# EAGLE design Board_v2 (EAGLE 8.1.0)
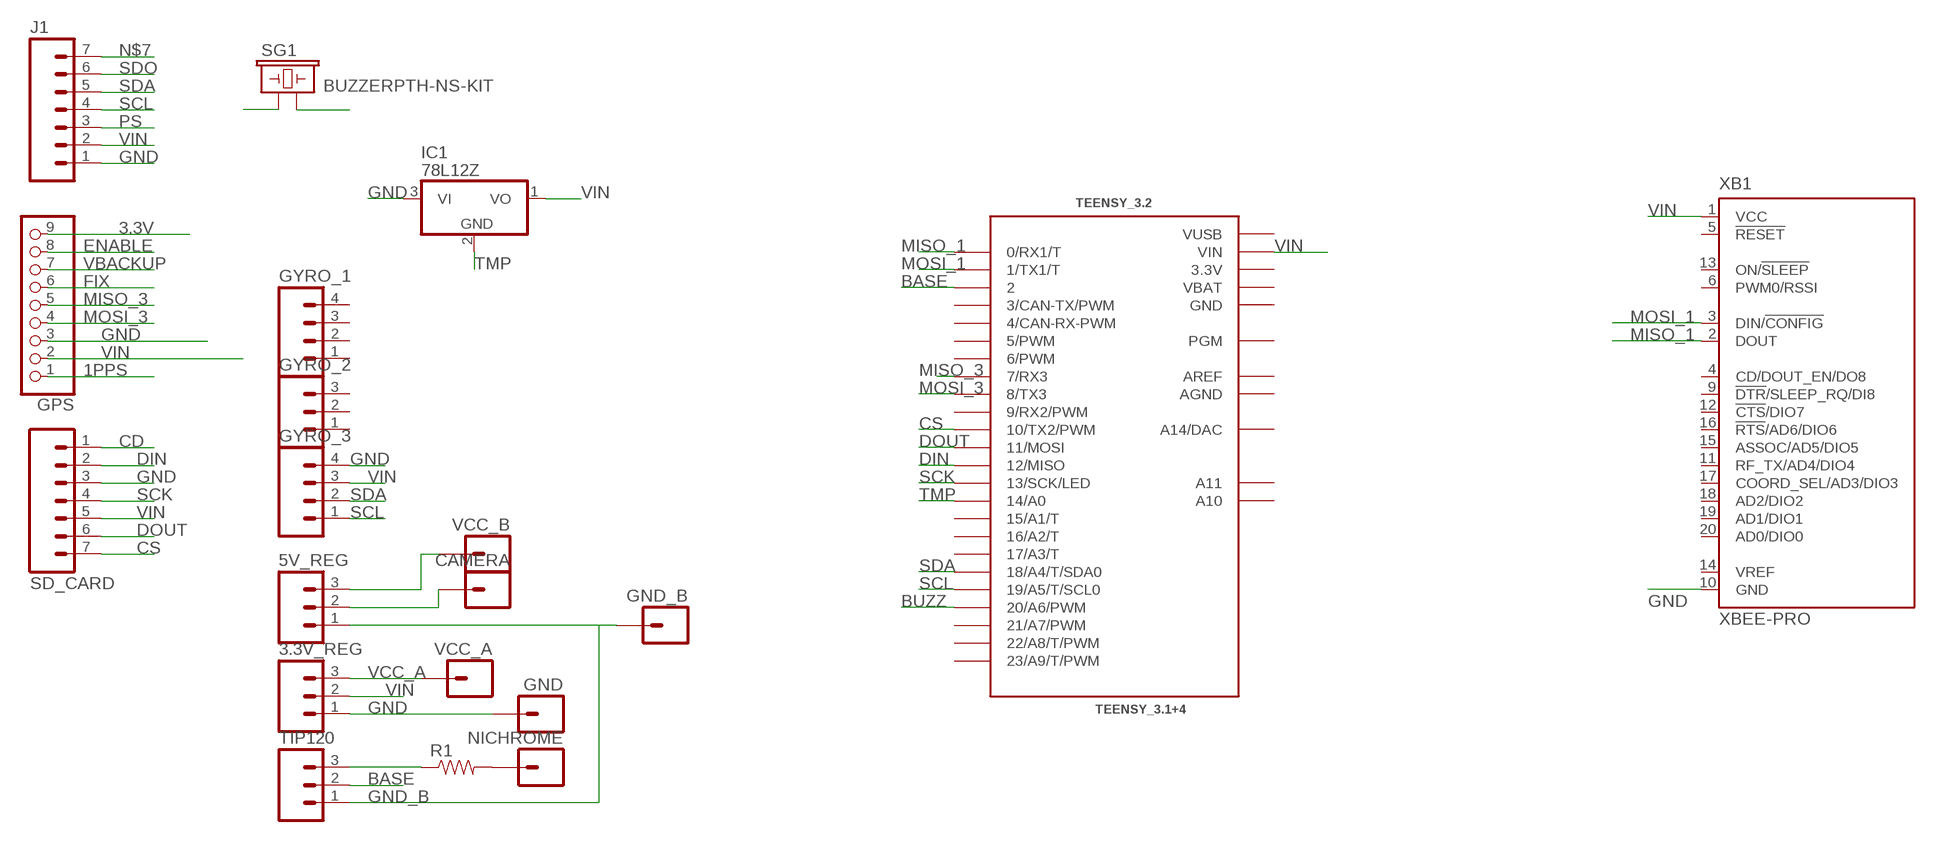
[diagram p0: schematic, sheet 1]

## Parts
3.3V_REG  M03PTH  [1X03]
5V_REG  M03PTH  [1X03]
CAMERA  M01NOSILK-KIT  [1X01NS-KIT]
GND  M01PTH_LONGPAD  [1X01_LONGPAD]
GND_B  M01OFFSET  [1X01_OFFSET]
GPS  HEADER-1X970MIL  [1X09_ROUND_70]
GYRO_1  M04PTH  [1X04]
GYRO_2  M03PTH  [1X03]
GYRO_3  M04PTH  [1X04]
IC1  78L12Z  [TO92]
J1  M07  [1X07]
NICHROME  M01OFFSET  [1X01_OFFSET]
R1  RESISTOREZ  [AXIAL-0.3EZ]
SD_CARD  M07  [1X07]
SG1  BUZZERPTH-NS-KIT  [BUZZER-12MM-NS-KIT]
TEENSY_3.2  TEENSY_3.1+4  [TEENSY_3.1+4]
TIP120  M03PTH  [1X03]
VCC_A  M01PTH_LONGPAD  [1X01_LONGPAD]
VCC_B  M01OFFSET  [1X01_OFFSET]
XB1  XBEE-PRO  [XBEE-PRO]

## Nets
1PPS: GPS.1
3.3V: GPS.9
BASE: TEENSY_3.2.2 TIP120.2
BUZZ: SG1.+ TEENSY_3.2.20/A6(20/A6/PWM)
CD: SD_CARD.1
CS: SD_CARD.7 TEENSY_3.2.10(10/TX2/PWM)
DIN: SD_CARD.2 TEENSY_3.2.12(12/MISO)
DOUT: SD_CARD.6 TEENSY_3.2.11(11/MOSI)
ENABLE: GPS.8
FIX: GPS.6
GND: 3.3V_REG.1 GND.1 GPS.3 GYRO_3.4 IC1.3(VI) J1.1 SD_CARD.3 SG1.- XB1.10(GND)
GND_B: 5V_REG.1 GND_B.1 TIP120.1
MISO_1: TEENSY_3.2.0(0/RX1/T) XB1.2(DOUT)
MISO_3: GPS.5 TEENSY_3.2.7(7/RX3)
MOSI_1: TEENSY_3.2.1(1/TX1/T) XB1.3(DIN/!CONFIG)
MOSI_3: GPS.4 TEENSY_3.2.8(8/TX3)
N$1: NICHROME.1 R1.P$2
N$2: R1.P$1 TIP120.3
N$4: 5V_REG.2 CAMERA.1
N$5: 5V_REG.3 VCC_B.1
N$7: J1.7
PS: J1.3
SCK: SD_CARD.4 TEENSY_3.2.13(13/SCK/LED)
SCL: GYRO_3.1 J1.4 TEENSY_3.2.19/A5(19/A5/T/SCL0)
SDA: GYRO_3.2 J1.5 TEENSY_3.2.18/A4(18/A4/T/SDA0)
SDO: J1.6
TMP: IC1.2(GND) TEENSY_3.2.14/A0
VBACKUP: GPS.7
VCC_A: 3.3V_REG.3 VCC_A.1
VIN: 3.3V_REG.2 GPS.2 GYRO_3.3 IC1.1(VO) J1.2 SD_CARD.5 TEENSY_3.2.VIN XB1.1(VCC)
Unconnected: GYRO_1.1 GYRO_1.2 GYRO_1.3 GYRO_1.4 GYRO_2.1 GYRO_2.2 GYRO_2.3 TEENSY_3.2.3(3/CAN-TX/PWM) TEENSY_3.2.4(4/CAN-RX-PWM) TEENSY_3.2.5(5/PWM) TEENSY_3.2.6(6/PWM) TEENSY_3.2.9(9/RX2/PWM) TEENSY_3.2.15/A1(15/A1/T) TEENSY_3.2.16/A2(16/A2/T) TEENSY_3.2.17/A3(17/A3/T) TEENSY_3.2.21/A7(21/A7/PWM) TEENSY_3.2.22/A8(22/A8/T/PWM) TEENSY_3.2.23/A9(23/A9/T/PWM) TEENSY_3.2.A10 TEENSY_3.2.A11 TEENSY_3.2.A14(A14/DAC) TEENSY_3.2.PGM XB1.4(CD/DOUT_EN/DO8) XB1.5(!RESET) XB1.6(PWM0/RSSI) XB1.9(!DTR!/SLEEP_RQ/DI8) XB1.11(RF_TX/AD4/DIO4) XB1.12(!CTS!/DIO7) XB1.13(ON/!SLEEP) XB1.14(VREF) XB1.15(ASSOC/AD5/DIO5) XB1.16(!RTS!/AD6/DIO6) XB1.17(COORD_SEL/AD3/DIO3) XB1.18(AD2/DIO2) XB1.19(AD1/DIO1) XB1.20(AD0/DIO0)

## Power pins joined to a net without a drawn wire
3.3V: TEENSY_3.2.3.3V TEENSY_3.2.3.3V1(3.3V)
AGND: TEENSY_3.2.AGND
AREF: TEENSY_3.2.AREF
GND: TEENSY_3.2.GND TEENSY_3.2.GND1(GND)
VBAT: TEENSY_3.2.VBAT
VUSB: TEENSY_3.2.VUSB

## Library data of the parts
3.3V_REG 5V_REG GYRO_2 TIP120 = SparkFun-Connectors:M03: Header 3 Standard 3-pin 0.1" header. Use with straight break away headers (SKU : PRT-00116), right angle break away headers (PRT-00553), swiss pins (PRT-00743), machine pins (PRT-00117), and female headers (PRT-00115). Molex polarized connector foot print use with SKU : PRT-08232 with associated crimp pins and housings.
CAMERA GND GND_B VCC_A VCC_B = SparkFun-Connectors:M01: Header 1
GPS = microbuilder:HEADER-1X9: PIN HEADER
GYRO_1 GYRO_3 = SparkFun-Connectors:M04: Header 4 Standard 4-pin 0.1" header. Use with straight break away headers (SKU : PRT-00116), right angle break away headers (PRT-00553), swiss pins (PRT-00743), machine pins (PRT-00117), and female headers (PRT-00115). Molex polarized connector foot print use with SKU : PRT-08231 with associated crimp pins and housings. 1MM SMD Version SKU: PRT-10208; PROD_ID: CONN-09696
IC1 = adafruit:78*: Positive VOLTAGE REGULATOR Added bigger pads to the TO-92 package
J1 SD_CARD = SparkFun-Connectors:M07: Header 7 Standard 7-pin 0.1" header. Use with straight break away headers (SKU : PRT-00116), right angle break away headers (PRT-00553), swiss pins (PRT-00743), machine pins (PRT-00117), and female headers (PRT-00115). NOTES ON THE VARIANTS LOCK and LOCK_LONGPADS... This footprint was designed to help hold the alignment of a through-hole component (i.e. 7-pin header) while soldering it into place. You may notice that each hole has been shifted either up or down by 0.005 of an inch from it's more standard position (which is usually a perfectly straight line). This slight alteration caused the pins (the squares in the middle) to touch the edges of the holes. Because they are alternating, it causes a "brace" to hold the header in place. 0.005 has proven to be the perfect amount of "off-center" position when using our standard breakaway headers. Although looks a little odd when you look at the bare footprint, once you have a header in there, the alteration is very hard to notice. Also, if you push a header all the way into place, it is covered up entirely on the bottom side. This idea of altering the position of holes to aid alignment will be further integrated into the Sparkfun Library for other footprints. It can help hold any component with 3 or more connection pins.
NICHROME = SparkFun:M01: Header 1
R1 = SparkFun-Passives:RESISTOR: Resistor Basic schematic elements and footprints for 0603, 1206, and PTH resistors.
SG1 = SparkFun:BUZZER: Buzzer 12mm Spark Fun Electronics SKU : Comp-Buzzer
TEENSY_3.2 = Teensy_3_Series_Board_v1.0:TEENSY_3.1+4: Footprint for Teensy 3.1 board using all through-holes, i.e. the entire perimeter plus the 4 through-holes inboard (A10,A11,AREF, VUSB)
XB1 = maxstream:XBEE: XBee (TM) /XBee-PRO(TM) OEM RF Modules Source: MaxStream, Inc. xbee_productmanual.pdf; MPN: XBP24-AWI-001; OC_FARNELL: 1337916; OC_NEWARK: 42M2667

## Board
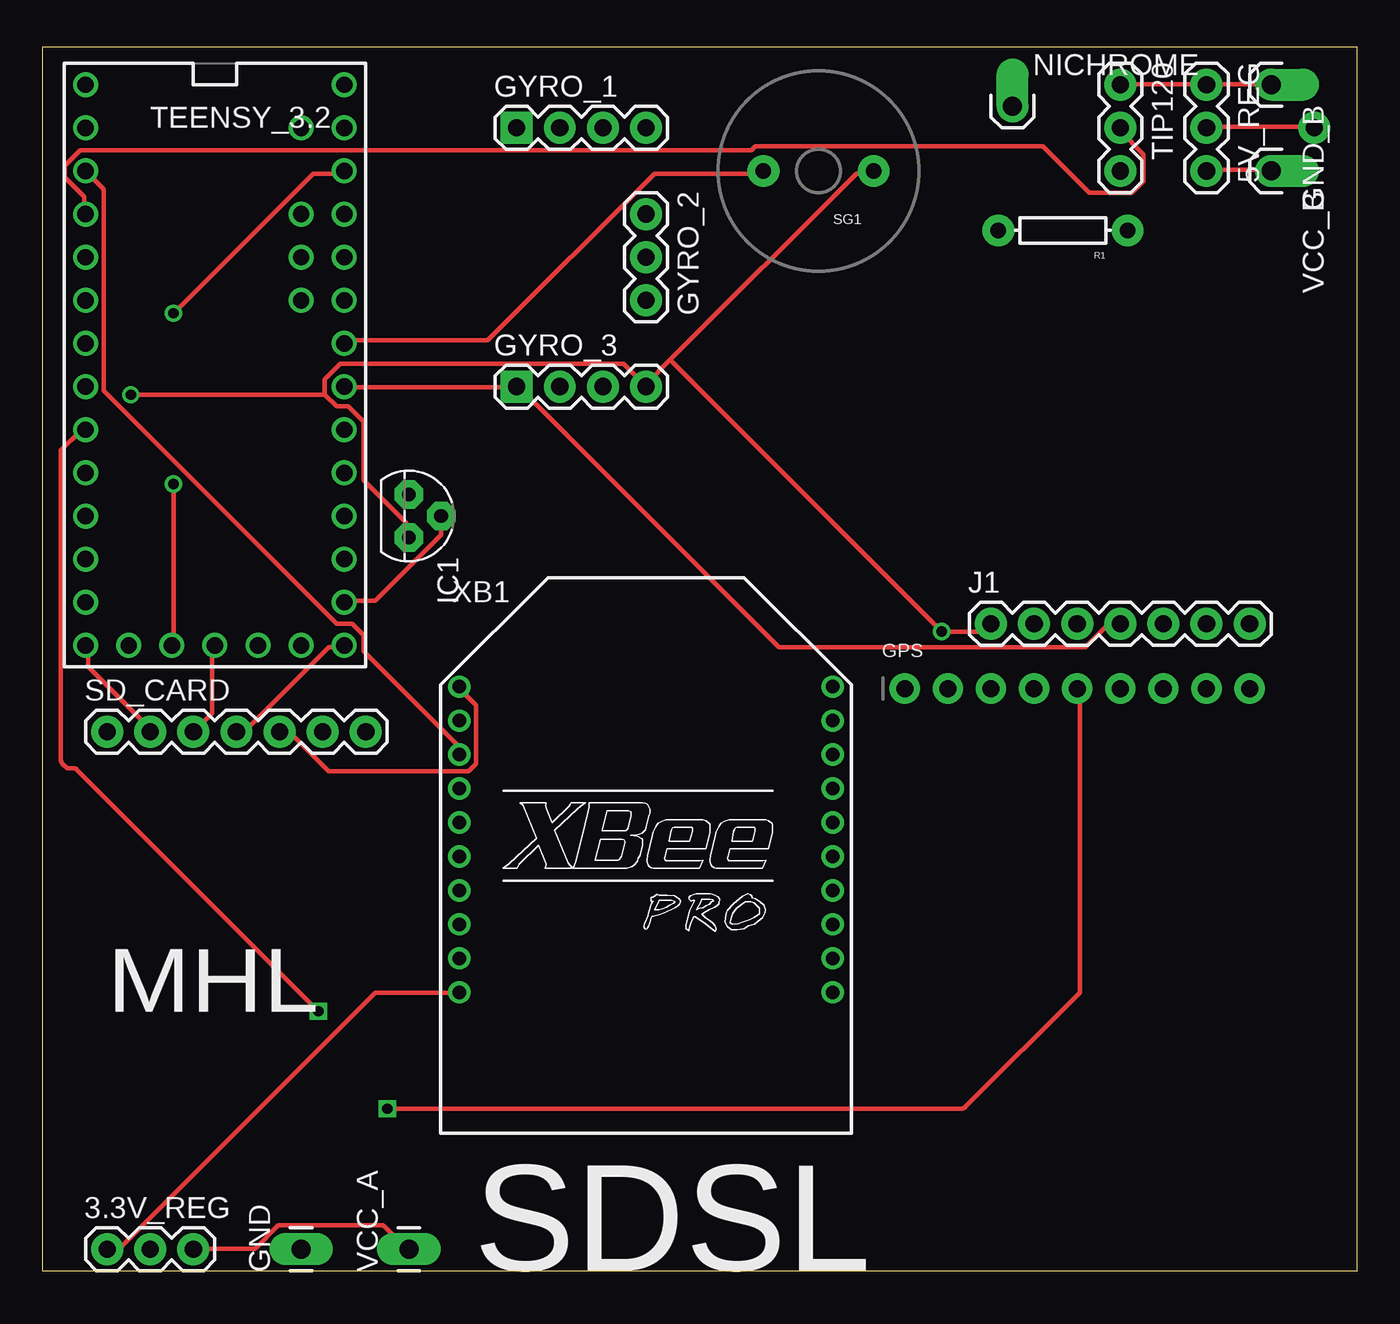
[diagram p1: board, top side]
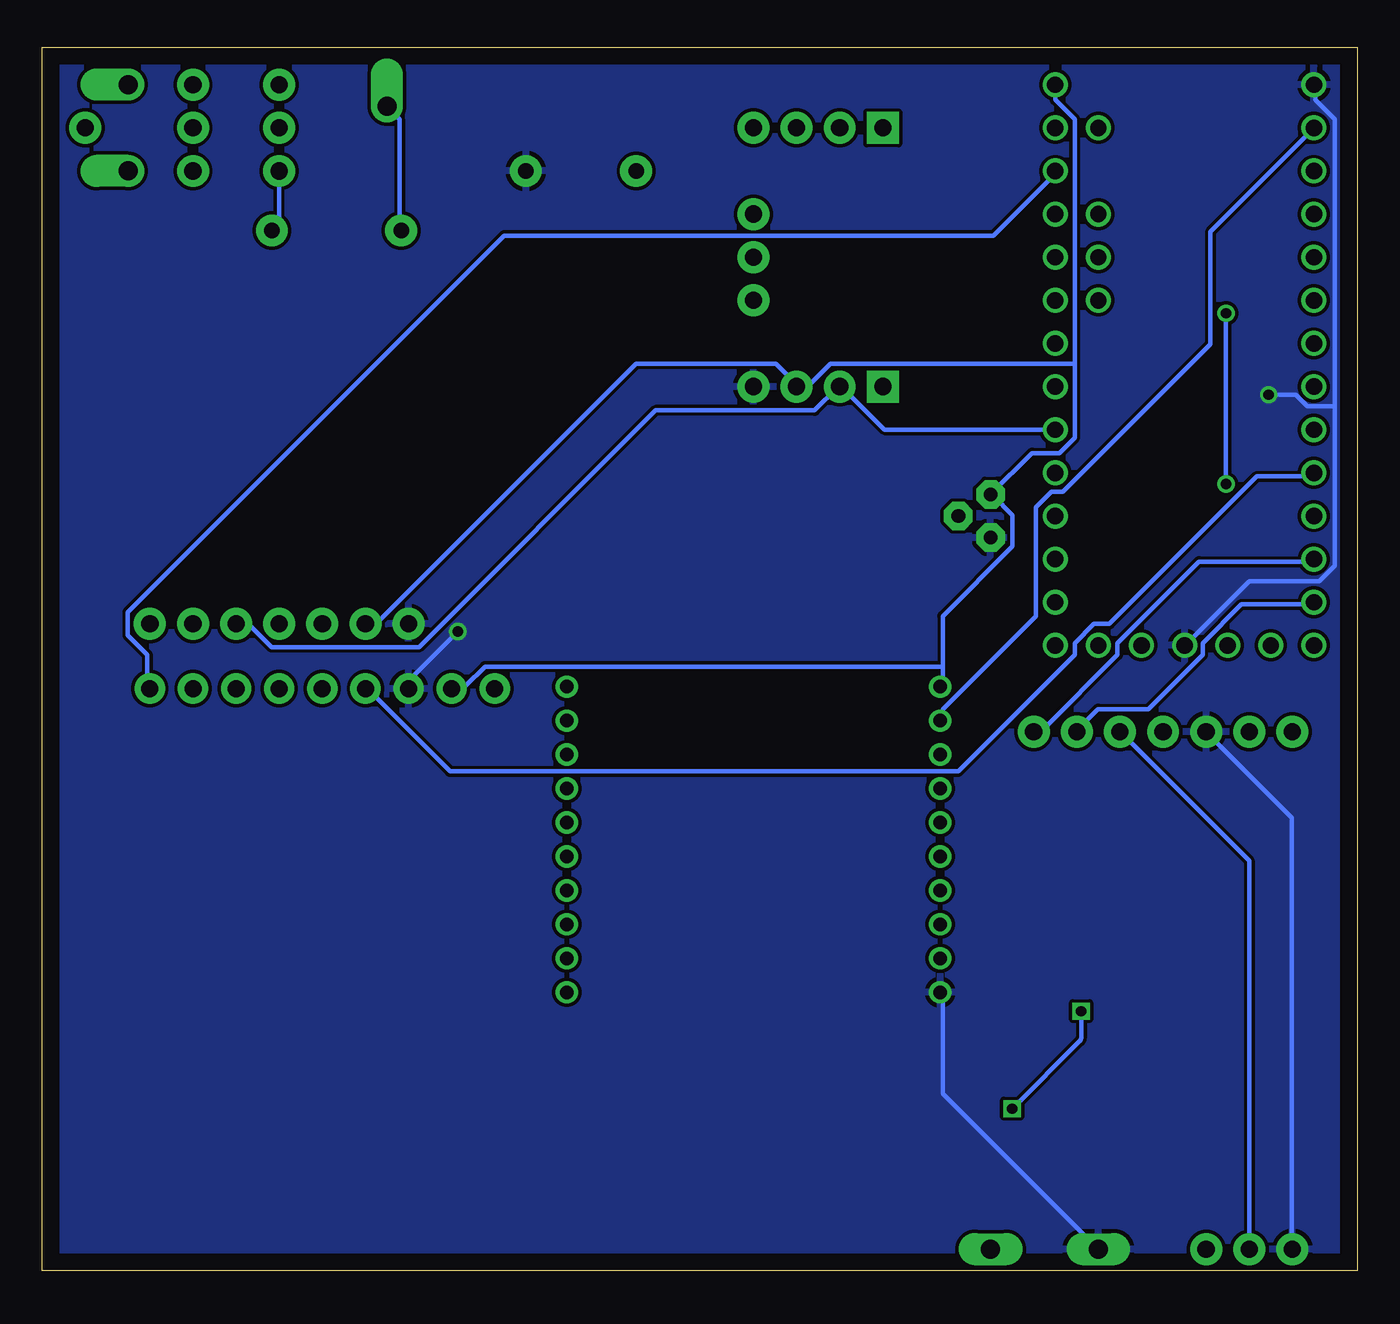
[diagram p2: board, bottom side, seen from below]

Size 77.45 x 72.06 mm. Coordinates in mm from the lower left corner, seen from the top.
Outline: 0,0 77.45,0 77.45,72.06 0,72.06 0,0
Copper layers (1*16): Top 0.035mm / dielectric 1.5mm / Bottom 0.035mm
Design rules "default": minimum track width 10mil, minimum drill 24mil, track to track 8mil, track to pad 8mil, pad to pad 8mil, via to via 8mil, smd to smd 8mil, copper to edge 40mil, drill to drill 8mil, minimum pad ring 10mil, minimum via ring 8mil, stop-mask expansion 4mil, vias tented up to drill 0mil, thermal gap 10mil

### Footprints (pad centres in the part's own frame; a part is rotated, then mirrored left to right if it is on the bottom)
1X03 = drill 1.016 pad 1.88: 1 0,0; 2 2.54,0; 3 5.08,0
1X01NS-KIT = drill 1.016 pad 1.88: 1 0,0
1X01_LONGPAD = drill 1.118 pad 1.88 long: 1 0,0
1X01_OFFSET = drill 1.118 pad 1.88 offset: 1 0,0
1X09_ROUND_70 = drill 1 pad 1.778: 1 -10.16,0; 2 -7.62,0; 3 -5.08,0; 4 -2.54,0; 5 0,0; 6 2.54,0; 7 5.08,0; 8 7.62,0; 9 10.16,0
1X04 = drill 1.016 pad 1.88 square: 1 0,0 | drill 1.016 pad 1.88: 2 2.54,0; 3 5.08,0; 4 7.62,0
TO92 = drill 0.813 pad 1.676 octagon: 1 -1.27,0; 2 0,1.905; 3 1.27,0
1X07 = drill 1.016 pad 1.88: 1 0,0; 2 2.54,0; 3 5.08,0; 4 7.62,0; 5 10.16,0; 6 12.7,0; 7 15.24,0
AXIAL-0.3EZ = drill 0.9 pad 1.88: P$1 -3.81,0; P$2 3.81,0
BUZZER-12MM-NS-KIT = drill 0.9 pad 1.88: + 3.25,0; - -3.25,0
TEENSY_3.1+4 = drill 0.965: 0 -7.62,15.24; 1 -7.62,12.7; 2 -7.62,10.16; 3 -7.62,7.62; 3.3V 7.62,12.7; 3.3V1 -2.54,-15.24; 4 -7.62,5.08; 5 -7.62,2.54; 6 -7.62,0; 7 -7.62,-2.54; 8 -7.62,-5.08; 9 -7.62,-7.62; 10 -7.62,-10.16; 11 -7.62,-12.7; 12 -7.62,-15.24; 13 7.62,-15.24; 14/A0 7.62,-12.7; 15/A1 7.62,-10.16; 16/A2 7.62,-7.62; 17/A3 7.62,-5.08; 18/A4 7.62,-2.54; 19/A5 7.62,0; 20/A6 7.62,2.54; 21/A7 7.62,5.08; 22/A8 7.62,7.62; 23/A9 7.62,10.16; A10 5.08,7.62; A11 5.08,5.08; A14 5.08,-15.24; AGND 7.62,15.24; AREF 5.08,10.16; GND -7.62,17.78; GND1 0,-15.24; PGM 2.54,-15.24; VBAT -5.08,-15.24; VIN 7.62,17.78; VUSB 5.08,15.24
XBEE-PRO = drill 0.8 pad 1.27: 1 -11,9; 2 -11,7; 3 -11,5; 4 -11,3; 5 -11,1; 6 -11,-1; 7 -11,-3; 8 -11,-5; 9 -11,-7; 10 -11,-9; 11 11,-9; 12 11,-7; 13 11,-5; 14 11,-3; 15 11,-1; 16 11,1; 17 11,3; 18 11,5; 19 11,7; 20 11,9

### Placement (x,y rotation side)
3.3V_REG  3.81,1.27 0 top
5V_REG  68.58,69.85 270 top
CAMERA  74.93,67.31 0 top
GND  15.24,1.27 90 top
GND_B  72.39,69.85 270 top
GPS  60.96,34.29 0 top
GYRO_1  27.94,67.31 0 top
GYRO_2  35.56,62.23 270 top
GYRO_3  27.94,52.07 0 top
IC1  21.59,44.45 270 top
J1  55.88,38.1 0 top
NICHROME  57.15,68.58 0 top
R1  60.12,61.26 180 top
SD_CARD  3.81,31.75 0 top
SG1  45.72,64.77 180 top
TEENSY_3.2  10.16,52.07 0 top
TIP120  63.5,69.85 270 top
VCC_A  21.59,1.27 90 top
VCC_B  72.39,64.77 270 top
XB1  35.56,25.4 0 top

### Tracks (layer width: path | path; a pad name or v marks a point on that pad's centre or on a via)
3.3V  (via drill 0.61)
  Top 0.254: v7.72,46.33 7.72,36.96 TEENSY_3.2.3.3V1 | v7.72,56.39 15.95,64.62 17.78,64.62 TEENSY_3.2.3.3V
  Bottom 0.254: v7.72,56.39 v7.72,46.33 | GPS.9 71.27,34.44 71.27,36.27 72.42,37.41 72.42,38.79 50.24,60.96 21.44,60.96 17.78,64.62 TEENSY_3.2.3.3V
BASE
  Top 0.254: TEENSY_3.2.2 2.46,62.33 2.46,63.25 1.32,64.39 1.32,65.07 2.24,65.99 41.78,65.99 42.01,66.22 58.93,66.22 61.67,63.48 64.19,63.48 64.87,64.16 64.87,65.76 63.5,67.13 TIP120.2
BUZZ
  Top 0.254: TEENSY_3.2.20/A6 17.78,54.79 26.24,54.79 36.07,64.62 42.47,64.62 SG1.+
CS
  Bottom 0.254: TEENSY_3.2.10 2.69,41.76 9.32,41.76 14.12,36.96 14.12,36.27 18.47,31.93 18.92,31.93 SD_CARD.7
DIN
  Top 0.254: TEENSY_3.2.12 2.69,36.73 2.69,35.59 6.35,31.93 SD_CARD.2
DOUT
  Bottom 0.254: TEENSY_3.2.11 2.69,39.24 6.81,39.24 9.09,36.96 9.09,36.27 12.29,33.07 15.26,33.07 16.41,31.93 SD_CARD.6
GND  (via drill 0.61)
  Top 0.254: J1.1 55.73,38.1 55.27,37.64 v52.98,37.64 36.98,53.65 | 16.64,51.59 17.32,50.9 18.01,50.9 18.92,49.99 18.92,46.56 21.44,44.04 21.44,43.36 IC1.3 | 16.64,51.59 16.64,52.5 17.55,53.42 34.24,53.42 35.38,52.27 GYRO_3.4 35.61,52.27 36.98,53.65 | 36.98,53.65 47.95,64.62 48.87,64.62 SG1.- | 3.3V_REG.1 3.83,1.29 4.52,1.29 19.61,16.38 24.41,16.38 XB1.10 | TEENSY_3.2.GND1 10.01,36.73 10.01,32.84 9.09,31.93 SD_CARD.3 | v5.21,51.59 16.64,51.59
  Bottom 0.254: v52.98,37.64 55.73,34.9 55.73,34.44 GPS.3 | GND.1 24.41,10.44 24.41,16.38 XB1.10 | 1.32,50.9 1.32,41.53 2.24,40.62 6.35,40.62 10.01,36.96 TEENSY_3.2.GND1 | 1.32,50.9 1.32,67.82 2.46,68.96 2.46,69.65 TEENSY_3.2.GND | 3.3V_REG.1 3.83,1.29 3.83,26.67 8.87,31.7 SD_CARD.3 | v5.21,51.59 3.61,51.59 2.92,50.9 1.32,50.9
  pour Bottom: 0,72.39 77.47,72.39 77.47,0.08 0,0
GND_B
  Top 0.254: TIP120.1 63.5,69.88 68.53,69.88 5V_REG.1 68.76,69.88 72.19,69.88 GND_B.1
MISO_1
  Bottom 0.254: XB1.2 24.41,32.61 24.41,33.07 18.92,38.56 18.92,44.96 18.01,45.87 17.32,45.87 8.64,54.56 8.64,61.19 2.69,67.13 TEENSY_3.2.0
MISO_3  (via drill 0.6)
  Top 0.254: TEENSY_3.2.7 2.39,49.53 arc45 2.21,49.46 1.09,48.34 1.09,30.05 arc45 1.17,29.87 1.45,29.59 1.85,29.59 arc-45 2.03,29.52 v16.26,15.29 | v20.32,9.55 54.18,9.55 arc45 54.35,9.62 61.11,16.38 61.11,34.03 arc45 61.04,34.21 GPS.5
  Bottom 0.254: v16.26,15.29 16.26,13.72 arc45 16.33,13.54 v20.32,9.55
MOSI_1
  Top 0.254: TEENSY_3.2.1 3.61,63.7 3.61,51.82 17.32,38.1 18.24,38.1 18.92,37.41 18.92,36.5 24.41,31.01 24.41,30.56 XB1.3
MOSI_3
  Bottom 0.254: TEENSY_3.2.8 2.69,46.79 5.89,46.79 14.58,38.1 15.49,38.1 16.64,36.96 16.64,36.27 23.49,29.41 53.44,29.41 58.24,34.21 GPS.4
N$1
  Bottom 0.254: R1.P$2 56.41,61.42 56.41,67.82 57.1,68.5 NICHROME.1
N$2
  Bottom 0.254: TIP120.3 63.5,61.65 63.73,61.42 R1.P$1
N$4
  Top 0.254: 5V_REG.2 68.76,67.36 74.93,67.36 CAMERA.1
N$5
  Top 0.254: 5V_REG.3 68.76,64.85 72.19,64.85 VCC_B.1
SCK
  Top 0.254: TEENSY_3.2.13 17.78,36.73 16.87,36.73 12.06,31.93 11.61,31.93 SD_CARD.4
SCL
  Top 0.254: TEENSY_3.2.19/A5 17.78,52.05 27.84,52.05 GYRO_3.1 28.07,52.05 43.38,36.73 61.44,36.73 62.81,38.1 J1.4
SDA
  Bottom 0.254: TEENSY_3.2.18/A4 27.84,49.53 30.35,52.05 GYRO_3.2 30.58,52.05 31.95,50.67 41.33,50.67 55.27,36.73 63.96,36.73 65.33,38.1 J1.5
TMP
  Top 0.254: IC1.2 23.49,43.36 19.61,39.47 17.78,39.47 TEENSY_3.2.14/A0
VCC_A
  Top 0.254: 3.3V_REG.3 9.09,1.29 12.52,1.29 13.89,2.67 20.07,2.67 21.44,1.29 VCC_A.1
VIN
  Top 0.254: SD_CARD.5 14.12,31.7 14.58,31.7 16.87,29.41 25.09,29.41 25.55,29.87 25.55,33.3 24.64,34.21 XB1.1
  Bottom 0.254: 3.3V_REG.2 6.35,24.15 13.89,31.7 SD_CARD.5 | 24.41,35.59 24.41,38.56 20.3,42.67 20.3,44.5 21.44,45.64 IC1.1 19.15,48.16 17.55,48.16 16.64,49.07 16.64,53.42 | 24.41,35.59 24.41,34.44 XB1.1 | TEENSY_3.2.VIN 17.78,68.96 16.64,67.82 16.64,53.42 | 24.41,35.59 51.38,35.59 52.53,34.44 53.21,34.44 GPS.2 | 16.64,53.42 31.04,53.42 32.18,52.27 32.87,52.27 GYRO_3.3 33.1,52.27 34.24,53.42 42.47,53.42 57.79,38.1 J1.2

### Text on the board
Measures: All units in inch | All units in inch
_tsilk: MHL | SDSL